# EAGLE design temp1 (EAGLE 6.4)
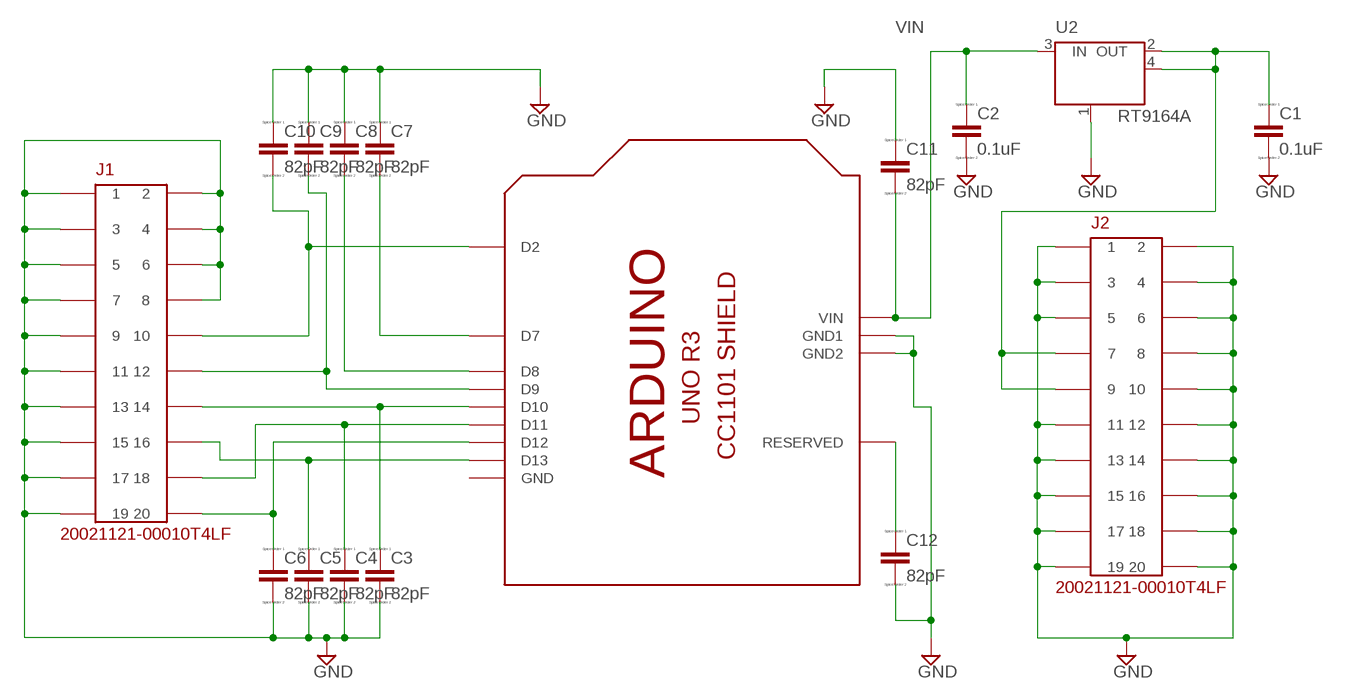
[diagram p0: schematic, sheet 1]

## Parts
C1  0.1uF  CC1206  [C1206]
C2  0.1uF  CC1206  [C1206]
C3  82pF  C  [C0805]
C4  82pF  C  [C0805]
C5  82pF  C  [C0805]
C6  82pF  C  [C0805]
C7  82pF  C  [C0805]
C8  82pF  C  [C0805]
C9  82pF  C  [C0805]
C10  82pF  C  [C0805]
C11  82pF  C  [C0805]
C12  82pF  C  [C0805]
J1  20021121-00010T4LF  [PINHDR10X2_50X50MIL_SMT]
J2  20021121-00010T4LF  [PINHDR10X2_50X50MIL_SMT]
U1  SHIELD-UNOR3-CC1101  [SHIELD-UNOR3-CC1101]
U2  RT9164A  [TO223]

## Nets
GND: C1.2 C2.2 C3.2 C4.2 C5.2 C6.2 C7.1 C8.1 C9.1 C10.1 C11.1 C12.2 J1.P$1 J1.P$2 J1.P$3 J1.P$4 J1.P$5 J1.P$6 J1.P$7 J1.P$8 J1.P$9 J1.P$11 J1.P$13 J1.P$15 J1.P$17 J1.P$19 J2.P$1 J2.P$2 J2.P$3 J2.P$4 J2.P$5 J2.P$6 J2.P$8 J2.P$10 J2.P$11 J2.P$12 J2.P$13 J2.P$14 J2.P$15 J2.P$16 J2.P$17 J2.P$18 J2.P$19 J2.P$20 U1.GND1 U1.GND2 U2.1(GND/ADJ)
N$1: C3.1 J1.P$14 U1.D10
N$2: C4.1 J1.P$18 U1.D11
N$3: C6.1 J1.P$20 U1.D12
N$4: C5.1 J1.P$16 U1.D13
N$5: C10.2 J1.P$10 U1.D2
N$6: C9.2 J1.P$12 U1.D9
N$7: C1.1 J2.P$7 J2.P$9 U2.2(OUT) U2.4(OUT)
N$8: C8.2 U1.D8
N$9: C7.2 U1.D7
N$10: C12.1 U1.RESERVED
VIN: C2.1 C11.2 U1.VIN U2.3(IN)

## Power pins joined to a net without a drawn wire
GND: U1.GND

## Library data of the parts
C1-C12 = eagle-ltspice:C: CAPACITOR, European symbol; SPICEMODEL: NONE; SPICEPREFIX: C
J1 J2 = fhpower:20021121-00010T4LF: 2x10 50mil Male Pin Header Unshrouded
U1 = adafruit-fh:SHIELD-UNOR3-CC1101
U2 = fhpower:RT9164A

## Board
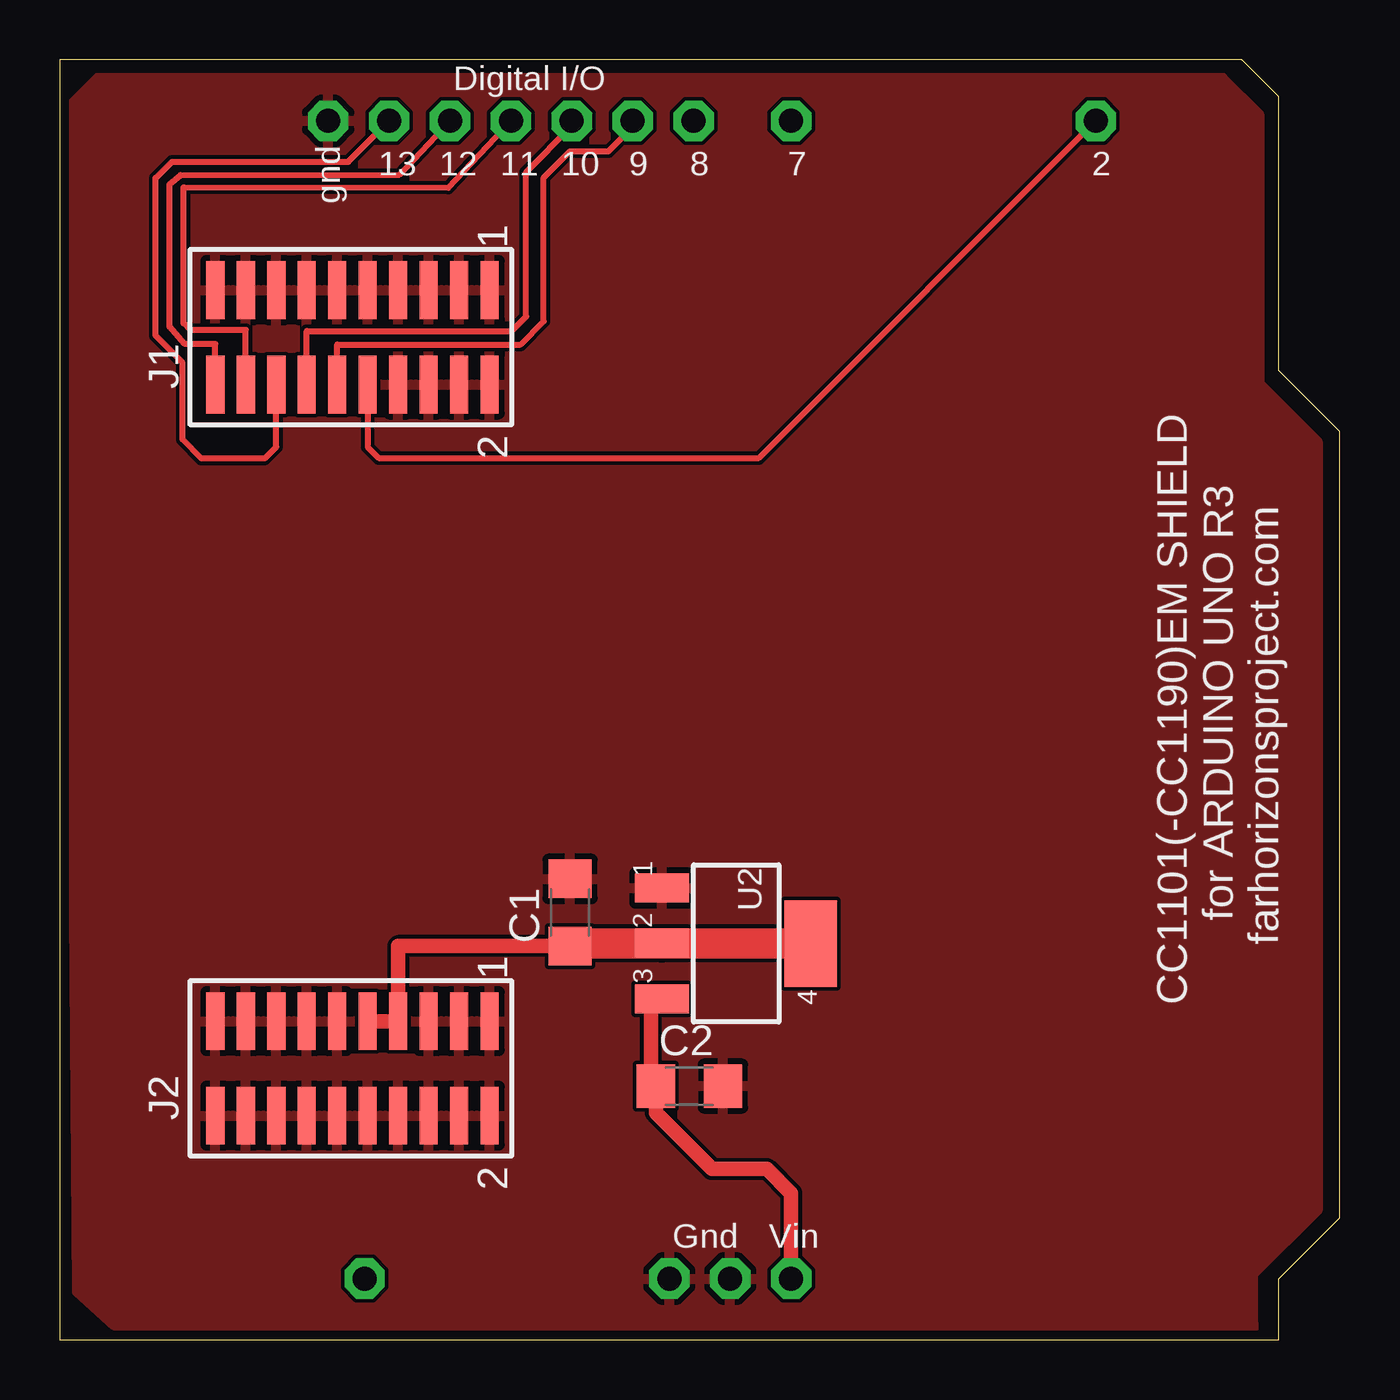
[diagram p1: board, top side]
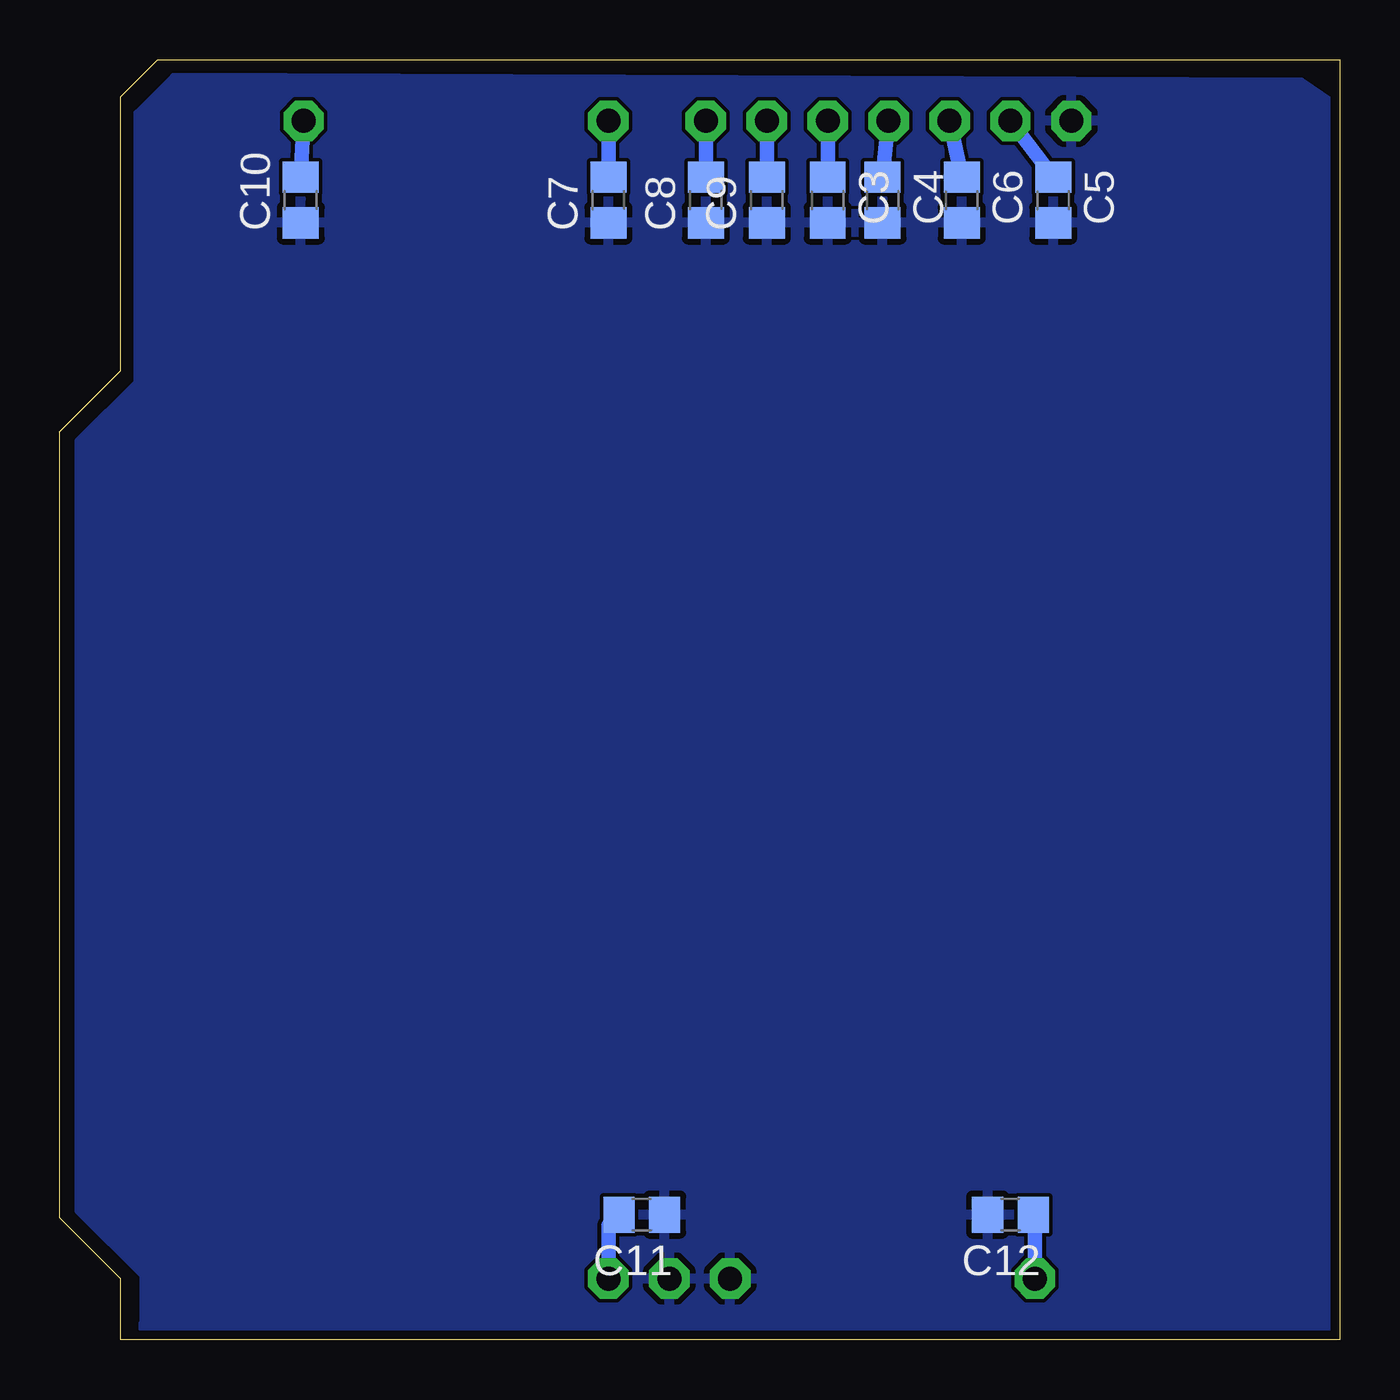
[diagram p2: board, bottom side, seen from below]

Size 53.34 x 53.34 mm. Coordinates in mm from the lower left corner, seen from the top.
Copper layers (1*16): Top 0.0356mm / dielectric 1.5011mm / Bottom 0.0356mm
Design rules "LaenPCBOrder": minimum track width 6mil, minimum drill 13mil, track to track 6mil, track to pad 6mil, pad to pad 6mil, via to via 6mil, smd to smd 6mil, copper to edge 15mil, drill to drill 6mil, minimum pad ring 7mil, minimum via ring 7mil, stop-mask expansion 4mil, vias tented up to drill 0mil, thermal gap 10mil

### Footprints (pad centres in the part's own frame; a part is rotated, then mirrored left to right if it is on the bottom)
C1206 = smd 1.6 x 1.8: 1 -1.4,0; 2 1.4,0
C0805 = smd 1.3 x 1.5: 1 -0.95,0; 2 0.95,0
PINHDR10X2_50X50MIL_SMT = smd 2.413 x 0.762: P$1 -1.968,5.715; P$2 1.968,5.715; P$3 -1.968,4.445; P$4 1.968,4.445; P$5 -1.968,3.175; P$6 1.968,3.175; P$7 -1.968,1.905; P$8 1.968,1.905; P$9 -1.968,0.635; P$10 1.968,0.635; P$11 -1.968,-0.635; P$12 1.968,-0.635; P$13 -1.968,-1.905; P$14 1.968,-1.905; P$15 -1.968,-3.175; P$16 1.968,-3.175; P$17 -1.968,-4.445; P$18 1.968,-4.445; P$19 -1.968,-5.715; P$20 1.968,-5.715
SHIELD-UNOR3-CC1101 = drill 1 pad 1.676 octagon: D2 43.18,50.8; D7 30.48,50.8; D8 26.416,50.8; D9 23.876,50.8; D10 21.336,50.8; D11 18.796,50.8; D12 16.256,50.8; D13 13.716,50.8; GND 11.176,50.8; GND1 27.94,2.54; GND2 25.4,2.54; RESERVED 12.7,2.54; VIN 30.48,2.54
TO223 = smd 1.219 x 2.235: 1 -2.311,-3.099; 2 0,-3.099; 3 2.311,-3.099 | smd 3.6 x 2.2: 4 0,3.099

### Placement (x,y rotation side)
C1  21.26,17.81 90 top
C2  26.24,10.57 0 top
C3  21.34,47.5 270 bottom
C4  19.05,47.5 270 bottom
C5  11.94,47.5 270 bottom
C6  15.75,47.5 270 bottom
C7  30.48,47.5 90 bottom
C8  26.42,47.5 90 bottom
C9  23.88,47.5 90 bottom
C10  43.31,47.5 90 bottom
C11  29.08,5.21 180 bottom
C12  13.72,5.21 180 bottom
J1  12.19,41.78 270 top
J2  12.19,11.3 270 top
U1  0,0 0 top
U2  28.19,16.51 270 top

### Tracks (layer width: path | path; a pad name or v marks a point on that pad's centre or on a via)
GND
  pour Bottom: 0.51,28.3 0.41,51.59 1.6,52.4 48.56,52.6 50.09,51.08 50.09,39.88 52.53,37.44 52.53,5.38 49.83,2.69 49.83,0.66 49.94,0.56 0.53,0.41 0.53,28.5
  pour Top: 0.58,48.87 0.56,51.59 1.57,52.6 48.46,52.6 49.99,51.08 49.99,39.88 52.43,37.44 52.43,5.38 49.73,2.69 49.73,0.66 49.83,0.56 2.31,0.56 0.71,1.98 0.51,28.4 0.43,33.91 0.41,43.56
N$1
  Top 0.254: U1.D10 21.34,50.57 19.43,48.67 19.43,42.65 18.82,42.04 10.29,42.04 J1.P$14
  Bottom 0.61: C3.1 U1.D10
N$2
  Top 0.254: U1.D11 16.18,48.01 5.18,48.03 5.16,48.03 5.16,42.37 5.44,42.09 7.75,42.09 J1.P$18
  Bottom 0.61: C4.1 U1.D11
N$3
  Top 0.254: U1.D12 14.15,48.56 5.03,48.54 4.57,48.16 4.57,42.22 5.21,41.5 6.48,41.5 J1.P$20
  Bottom 0.61: C6.1 U1.D12
N$4
  Top 0.254: U1.D13 12.01,49.1 4.67,49.1 3.99,48.41 3.99,41.86 5.11,40.72 5.11,37.52 5.89,36.73 8.53,36.73 9.02,37.21 J1.P$16
  Bottom 0.61: C5.1 U1.D13
N$5
  Top 0.254: U1.D2 29.13,36.75 13.28,36.75 12.83,37.21 J1.P$10
  Bottom 0.61: C10.2 U1.D2
N$6
  Top 0.254: U1.D9 23.88,50.55 22.86,49.53 21.26,49.53 20.17,48.44 20.17,42.44 19.2,41.48 11.56,41.48 J1.P$12
  Bottom 0.61: C9.2 U1.D9
N$7
  Top 0.254: 21.14,16.41 C1.1
  Top 0.61: C1.1 14.1,16.41 J2.P$7 J2.P$9
  Top 1.27: 21.21,16.48 C1.1 21.24,16.51 U2.2 U2.4
N$8
  Bottom 0.61: C8.2 U1.D8
N$9
  Bottom 0.61: C7.2 U1.D7
N$10
  Bottom 0.61: C12.1 12.7,5.14 U1.RESERVED
VIN
  Top 0.61: U2.3 24.64,13.97 24.64,11.07 C2.1 24.84,9.45 27.18,7.11 29.46,7.11 30.48,6.1 U1.VIN
  Bottom 0.61: U1.VIN 30.48,4.76 C11.2